# EAGLE design RCM-comm_v1 (EAGLE 6.5.0)
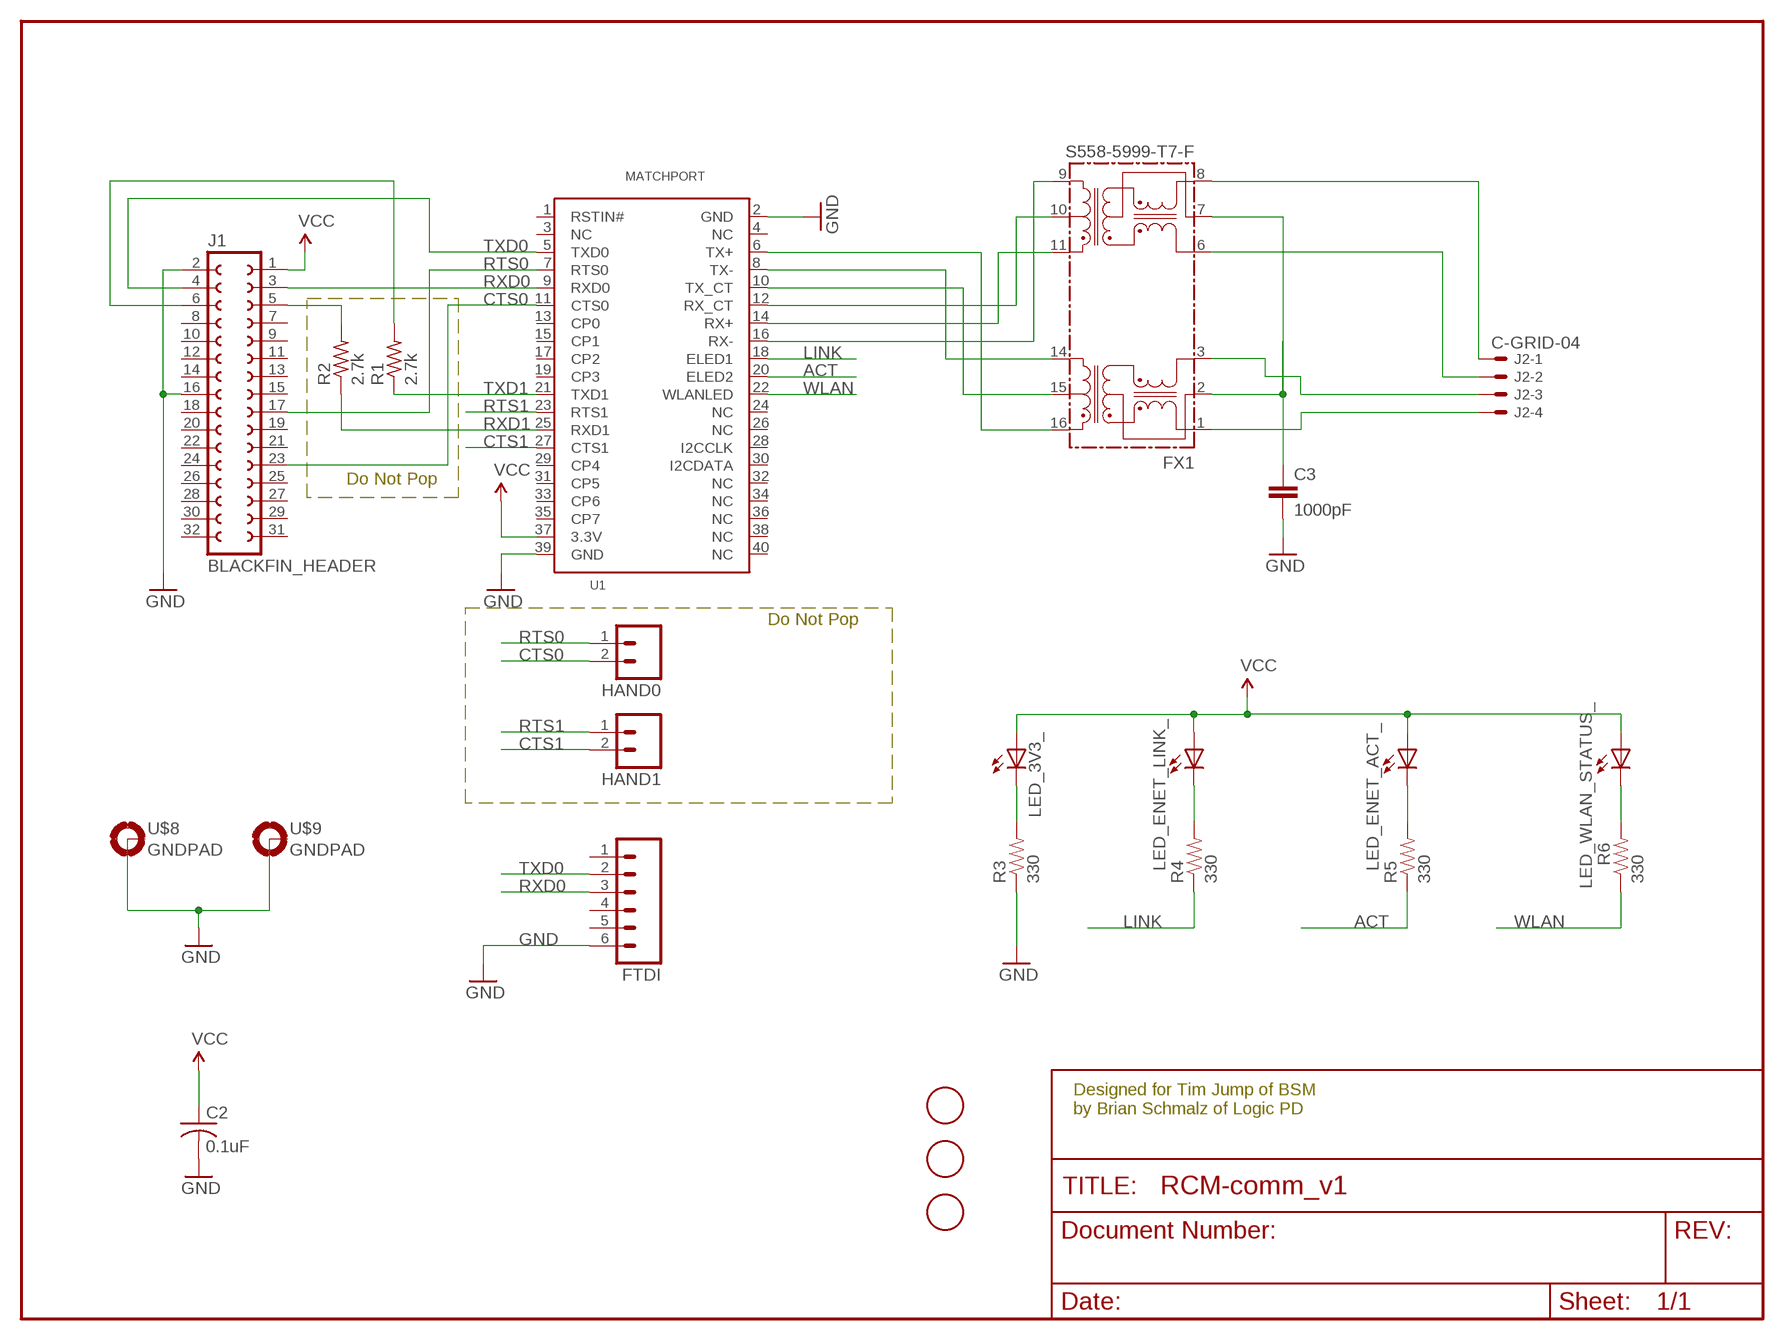
[diagram p0: schematic, sheet 1]

## Parts
C2  0.1uF  C-USC0603  [C0603]
C3  1000pF  CAP0603-CAP  [0603-CAP]
FID1  FIDUCIAL  [FIDUCIAL_1MM]
FID2  FIDUCIAL  [FIDUCIAL_1MM]
FID3  FIDUCIAL  [FIDUCIAL_1MM]
FTDI  M06SIP  [1X06]
FX1  S558-5999-T7-F  TG110-E050N5  [N5]
HAND0  M02PTH  [1X02]
HAND1  M02PTH  [1X02]
J1  BLACKFIN_HEADER  [2X16]
J2-  C-GRID-04  [70555-04]
LED_3V3_  LED0603  [LED-0603]
LED_ENET_ACT_  LED0603  [LED-0603]
LED_ENET_LINK_  LED0603  [LED-0603]
LED_WLAN_STATUS_  LED0603  [LED-0603]
R1  2.7k  R-US_0207/10  [0207/10]
R2  2.7k  R-US_0207/10  [0207/10]
R3  330  RESISTOR0603-RES  [0603-RES]
R4  330  RESISTOR0603-RES  [0603-RES]
R5  330  RESISTOR0603-RES  [0603-RES]
R6  330  RESISTOR0603-RES  [0603-RES]
U1  MATCHPORT  [MATCHPORT_LAYOUT]
U$8  GNDPAD  [GNDPAD]
U$9  GNDPAD  [GNDPAD]

## Nets
ACT: R5.1 U1.20(ELED2)
CTS0: HAND0.2 J1.23(GP6) U1.11(CTS0)
CTS1: HAND1.2 U1.27(CTS1)
GND: C2.2 C3.2 FTDI.6 J1.2(GND) J1.16(GND16) R3.1 U1.2(GND) U1.39(GND) U$8.P$1(MOUNT) U$9.P$1(MOUNT)
LINK: R4.1 U1.18(ELED1)
N$1: FX1.2
N$3: LED_3V3_.C R3.2
N$5: LED_ENET_LINK_.C R4.2
N$6: LED_ENET_ACT_.C R5.2
N$8: LED_WLAN_STATUS_.C R6.2
N$11: C3.1 FX1.7
N$12: FX1.15 U1.10(TX_CT)
N$13: FX1.16 U1.6(TX+)
N$14: FX1.14 U1.8(TX-)
N$15: FX1.10 U1.12(RX_CT)
N$16: FX1.11 U1.14(RX+)
N$17: FX1.9 U1.16(RX-)
N$18: FX1.1 J2-.4
N$19: FX1.3 J2-.3
N$20: FX1.8 J2-.1
N$21: FX1.6 J2-.2
N$24: J1.6(RX1) R1.2
N$26: J1.5(TX1) R2.2
RTS0: HAND0.1 J1.17(GP0) U1.7(RTS0)
RTS1: HAND1.1 U1.23(RTS1)
RXD0: FTDI.3 J1.3(TX0) U1.9(RXD0)
RXD1: R2.1 U1.25(RXD1)
TXD0: FTDI.2 J1.4(RX0) U1.5(TXD0)
TXD1: R1.1 U1.21(TXD1)
VCC: C2.1 J1.1(3.3V) LED_3V3_.A LED_ENET_ACT_.A LED_ENET_LINK_.A LED_WLAN_STATUS_.A U1.37(3.3V)
WLAN: R6.1 U1.22(WLANLED)
Unconnected: FTDI.1 FTDI.4 FTDI.5 J1.7(TMR2) J1.8(TMR3) J1.9(SPI_MOSI) J1.10(SPI_MISO) J1.11(SPI_SCK) J1.12(SPI_SEL) J1.13(SPI_SEL2) J1.14(SPI_SCL) J1.15(I2C_SDA) J1.18(GP1) J1.19(GP2) J1.20(GP3) J1.21(GP4) J1.22(GP5) J1.24(GP7) J1.25(GP8) J1.26(GP9) J1.27(GPA) J1.28(GPB) J1.29(GPC) J1.30(GPD) J1.31(GPE) J1.32(GPF) U1.1(RSTIN#) U1.3(NC) U1.4(NC) U1.13(CP0) U1.15(CP1) U1.17(CP2) U1.19(CP3) U1.24(NC) U1.26(NC) U1.28(I2CCLK) U1.29(CP4) U1.30(I2CDATA) U1.31(CP5) U1.32(NC) U1.33(CP6) U1.34(NC) U1.35(CP7) U1.36(NC) U1.38(NC) U1.40(NC)

## Notes on the sheet
- Do Not Pop
- Do Not Pop
- Designed for Tim Jump of BSM
  by Brian Schmalz of Logic PD

## Library data of the parts
C2 = rcl:C-US: CAPACITOR, American symbol
C3 = spark_fun:CAP: Capacitor Standard 0603 ceramic capacitor, and 0.1" leaded capacitor.
FID1-FID3 = adafruit:FIDUCIAL: For use by pick and place machines to calibrate the vision/machine, 1mm By microbuilder.eu
FTDI = spark_fun:M06: Header 6 Standard 6-pin 0.1" header. Use with straight break away headers (SKU : PRT-00116), right angle break away headers (PRT-00553), swiss pins (PRT-00743), machine pins (PRT-00117), and female headers (PRT-00115). Molex polarized connector foot print use with SKU : PRT-08094 with associated crimp pins and housings. NOTES ON THE VARIANTS LOCK and LOCK_LONGPADS... This footprint was designed to help hold the alignment of a through-hole component (i.e. 6-pin header) while soldering it into place. You may notice that each hole has been shifted either up or down by 0.005 of an inch from it's more standard position (which is a perfectly straight line). This slight alteration caused the pins (the squares in the middle) to touch the edges of the holes. Because they are alternating, it causes a "brace" to hold the component in place. 0.005 has proven to be the perfect amount of "off-center" position when using our standard breakaway headers. Although looks a little odd when you look at the bare footprint, once you have a header in there, the alteration is very hard to notice. Also, if you push a header all the way into place, it is covered up entirely on the bottom side. This idea of altering the position of holes to aid alignment will be further integrated into the Sparkfun Library for other footprints. It can help hold any component with 3 or more connection pins.
FX1 = halo-electronics:TG110-E050N5: E-Ultra (TM) 10/100BASE-TX SOIC-16 Fast Ethernet Magnetic Modules Source: www.haloelectronics.com .. e-ultra.pdf
HAND0 HAND1 = spark_fun:M02: Header 2 Standard 2-pin 0.1" header. Use with straight break away headers (SKU : PRT-00116), right angle break away headers (PRT-00553), swiss pins (PRT-00743), machine pins (PRT-00117), and female headers (PRT-00115). Molex polarized connector foot print use with SKU : PRT-08233 with associated crimp pins and housings.
J1 = Surveyor:BLACKFIN_HEADER
J2- = MolexConnector:C-GRID-04
LED_3V3_ LED_ENET_ACT_ LED_ENET_LINK_ LED_WLAN_STATUS_ = spark_fun:LED: LEDs Standard schematic elements and footprints for 5mm, 3mm, 1206, and 0603 sized LEDs. 5mm - Spark Fun Electronics SKU : COM-00529 (and others)
R1 R2 = rcl:R-US_: RESISTOR, American symbol
R3-R6 = spark_fun:RESISTOR: Resistor Basic schematic elements and footprints for 0603, 1206, and PTH resistors.
U1 = Matchport_Wiport:MATCHPORT
U$8 U$9 = Surveyor:GNDPAD

## Board
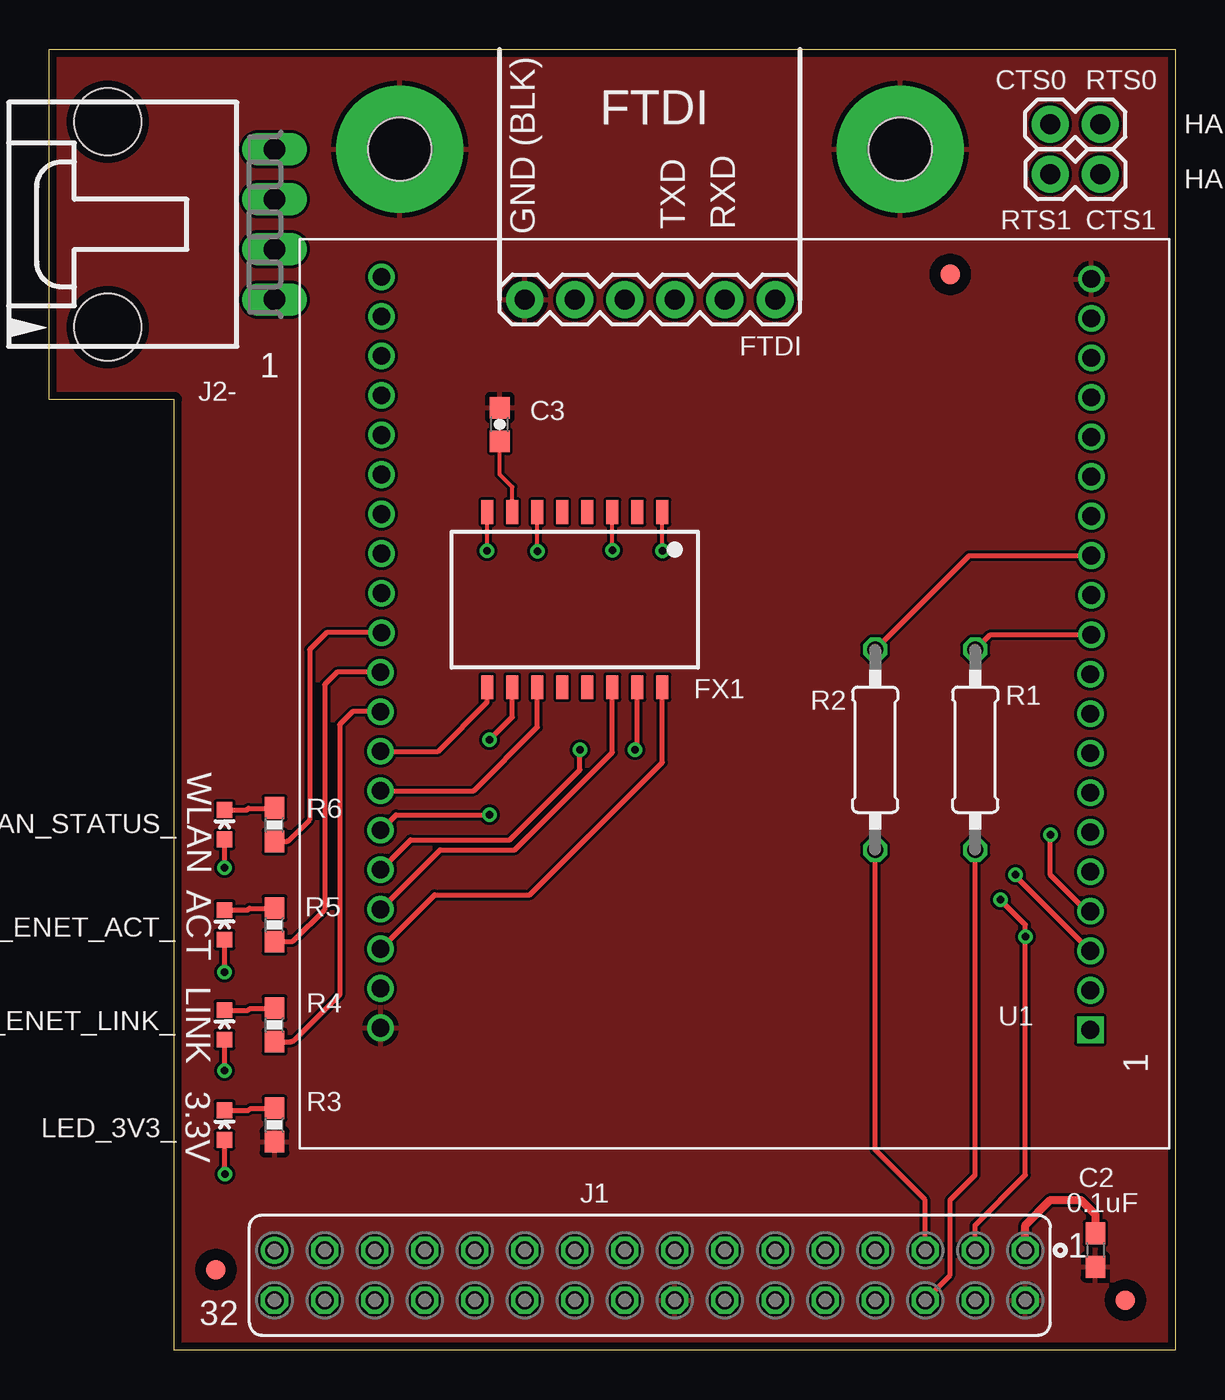
[diagram p1: board, top side]
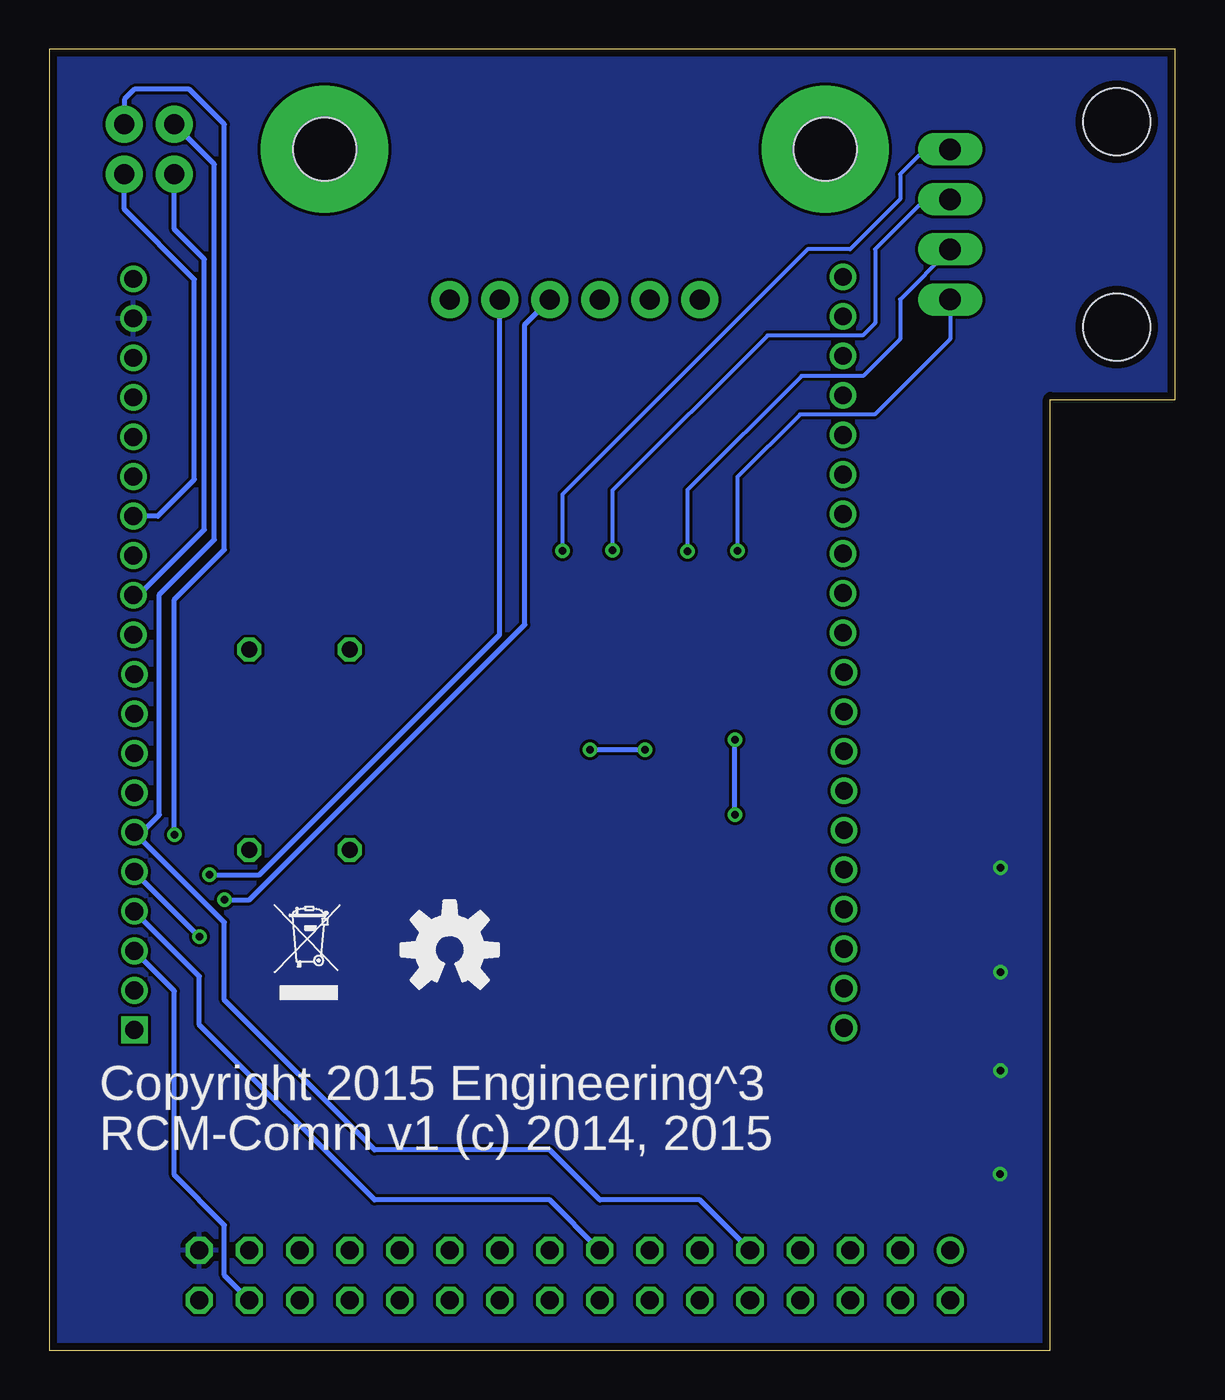
[diagram p2: board, bottom side, seen from below]

Size 57.15 x 66.05 mm. Coordinates in mm from the lower left corner, seen from the top.
Outline: 0,66.05 57.15,66.05 57.15,43.69 57.15,0 6.35,0.01 6.35,48.27 0,48.27 0,66.05
Copper layers (1*16): Top 0.0356mm / dielectric 1.5011mm / Bottom 0.0356mm
Design rules "LaenPCBOrder": minimum track width 6mil, minimum drill 13mil, track to track 6mil, track to pad 6mil, pad to pad 6mil, via to via 6mil, smd to smd 6mil, copper to edge 15mil, drill to drill 6mil, minimum pad ring 7mil, minimum via ring 7mil, stop-mask expansion 3mil, vias tented up to drill 0mil, thermal gap 10mil

### Footprints (pad centres in the part's own frame; a part is rotated, then mirrored left to right if it is on the bottom)
C0603 = smd 1.1 x 1: 1 -0.85,0; 2 0.85,0
0603-CAP = smd 1.1 x 1: 1 -0.85,0; 2 0.85,0
FIDUCIAL_1MM = smd 1 x 1: 1 0,0
1X06 = drill 1.016 pad 1.88: 1 0,0; 2 2.54,0; 3 5.08,0; 4 7.62,0; 5 10.16,0; 6 12.7,0
N5 = smd 0.6 x 1.2: 1 -4.445,-4.445; 2 -3.175,-4.445; 3 -1.905,-4.445; 4 -0.635,-4.445; 5 0.635,-4.445; 6 1.905,-4.445; 7 3.175,-4.445; 8 4.445,-4.445; 9 4.445,4.445; 10 3.175,4.445; 11 1.905,4.445; 12 0.635,4.445; 13 -0.635,4.445; 14 -1.905,4.445; 15 -3.175,4.445; 16 -4.445,4.445
1X02 = drill 1.016 pad 1.88: 1 0,0; 2 2.54,0
2X16 = drill 0.914 octagon: 1 20.32,1.27; 2 20.32,-1.27; 3 17.78,1.27; 4 17.78,-1.27; 5 15.24,1.27; 6 15.24,-1.27; 7 12.7,1.27; 8 12.7,-1.27; 9 10.16,1.27; 10 10.16,-1.27; 11 7.62,1.27; 12 7.62,-1.27; 13 5.08,1.27; 14 5.08,-1.27; 15 2.54,1.27; 16 2.54,-1.27; 17 0,1.27; 18 0,-1.27; 19 -2.54,1.27; 20 -2.54,-1.27; 21 -5.08,1.27; 22 -5.08,-1.27; 23 -7.62,1.27; 24 -7.62,-1.27; 25 -10.16,1.27; 26 -10.16,-1.27; 27 -12.7,1.27; 28 -12.7,-1.27; 29 -15.24,1.27; 30 -15.24,-1.27; 32 -17.78,-1.27 | drill 0.914: 31 -17.78,1.27
70555-04 = drill 1.092 long: 1 -3.81,0; 2 -1.27,0; 3 1.27,0; 4 3.81,0 | hole 3.404: -5.207,8.458; 5.207,8.458
LED-0603 = smd 0.8 x 0.8: A 0,-0.75; C 0,0.75
0207/10 = drill 0.813 octagon: 1 -5.08,0; 2 5.08,0
0603-RES = smd 1.1 x 1: 1 -0.85,0; 2 0.85,0
MATCHPORT_LAYOUT = drill 0.9 square: 1 0,0 | drill 0.9: 2 36.017,-0.102; 3 0,-2.007; 4 36.017,-2.108; 5 0,-4.013; 6 36.017,-4.115; 7 0,-6.02; 8 36.017,-6.121; 9 0,-8.026; 10 36.017,-8.128; 11 0,-10.033; 12 36.017,-10.135; 13 0,-12.04; 14 36.017,-12.141; 15 0,-14.046; 16 36.017,-14.148; 17 0,-16.053; 18 36.017,-16.154; 19 0,-18.059; 20 36.017,-18.161; 21 -0.051,-20.066; 22 35.966,-20.168; 23 -0.051,-22.073; 24 35.966,-22.174; 25 -0.051,-24.079; 26 35.966,-24.181; 27 -0.051,-26.086; 28 35.966,-26.187; 29 -0.051,-28.092; 30 35.966,-28.194; 31 -0.051,-30.099; 32 35.966,-30.201; 33 -0.051,-32.106; 34 35.966,-32.207; 35 -0.051,-34.112; 36 35.966,-34.214; 37 -0.051,-36.119; 38 35.966,-36.22; 39 -0.051,-38.125; 40 35.966,-38.227
GNDPAD = drill 3.2 pad 6.452: P$1 0,0 | hole 3.2: 0,0

### Placement (x,y rotation side)
C2  53.09,5.08 270 top
C3  22.86,47 90 top
FID1  8.46,4.09 0 top
FID2  45.72,54.62 0 top
FID3  54.61,2.54 0 top
FTDI  36.83,53.35 180 top
FX1  26.67,38.11 180 top
HAND0  53.34,62.23 180 top
HAND1  50.8,59.7 0 top
J1  29.21,3.81 0 top
J2-  11.43,57.16 90 top
LED_3V3_  8.89,11.44 0 top
LED_ENET_ACT_  8.89,21.59 0 top
LED_ENET_LINK_  8.89,16.52 0 top
LED_WLAN_STATUS_  8.89,26.68 0 top
LOGO1  OSHW-LOGOM  [OSHW-LOGO-M]  36.83,20.32 0 bottom
R1  46.99,30.48 270 top
R2  41.91,30.48 270 top
R3  11.43,11.44 90 top
R4  11.43,16.52 90 top
R5  11.43,21.59 90 top
R6  11.43,26.68 90 top
U1  52.83,16.26 180 top
U$3  ROHS_GARBAGE  [ROHS_GARBAGE_5MM]  45.72,17.79 0 bottom
U$8  17.78,60.97 90 top
U$9  43.18,60.97 0 top

### Tracks (layer width: path | path; a pad name or v marks a point on that pad's centre or on a via)
ACT
  Top 0.254: U1.20 14.61,34.42 13.97,33.79 13.97,22.36 12.43,20.82 arc-45 12.25,20.74 R5.1
CTS0
  Bottom 0.254: J1.23 24.13,7.62 29.21,7.62 31.75,10.17 40.64,10.17 48.26,17.79 48.26,21.72 U1.11 52.45,26.29 51.56,27.18 51.56,38.36 48.77,41.15 48.77,60.2 HAND0.2
CTS1
  Bottom 0.254: U1.27 51.64,42.35 49.78,44.2 49.78,54.36 53.34,57.92 HAND1.2
GND
  pour Top: 0,66.05 57.15,66.05 57.15,0.01 6.35,0.01 6.35,48.27 0,48.27
LINK
  Top 0.254: U1.18 15.39,32.41 14.73,31.75 14.73,18.04 12.43,15.74 arc-45 12.25,15.67 R4.1
N$3
  Top 0.254: LED_3V3_.C 10.12,12.19 10.21,12.27 11.42,12.27 R3.2
N$5
  Top 0.254: LED_ENET_LINK_.C 10.1,17.27 10.19,17.35 11.42,17.35 R4.2
N$6
  Top 0.254: LED_ENET_ACT_.C 10.07,22.34 10.16,22.43 11.42,22.43 R5.2
N$8
  Top 0.254: LED_WLAN_STATUS_.C 10.02,27.43 10.11,27.51 11.42,27.51 R6.2
N$11
  Top 0.203: FX1.7 23.49,43.82 22.86,44.46 C3.1
N$12  (via drill 0.38)
  Top 0.254: FX1.15 29.84,30.61 v29.72,30.48 | v26.92,30.48 26.92,29.47 23.37,25.91 18.34,25.91 U1.10
  Bottom 0.254: v26.92,30.48 v29.72,30.48
N$13
  Top 0.254: U1.6 19.56,23.12 24.38,23.12 31.11,29.85 FX1.16
N$14
  Top 0.254: FX1.14 28.57,30.36 23.62,25.4 19.84,25.4 U1.8
N$15  (via drill 0.38)
  Top 0.254: FX1.10 23.49,32.14 v22.35,30.99 | v22.35,27.18 17.6,27.18 U1.12
  Bottom 0.254: v22.35,27.18 v22.35,30.99
N$16
  Top 0.254: FX1.11 24.76,31.63 21.54,28.4 U1.14
N$17
  Top 0.254: U1.16 19.74,30.41 22.22,32.9 FX1.9
N$18  (via drill 0.38)
  Top 0.203: v31.11,40.59 FX1.1
  Bottom 0.203: v31.11,40.59 31.11,43.44 18.67,55.89 16.51,55.89 13.97,58.43 13.97,59.7 12.7,60.97 J2-.4
N$19  (via drill 0.38)
  Top 0.203: v28.57,40.62 FX1.3
  Bottom 0.203: v28.57,40.62 28.57,43.64 20.7,51.52 15.88,51.52 15.24,52.15 15.24,55.89 12.7,58.43 J2-.3
N$20  (via drill 0.38)
  Top 0.203: v22.22,40.59 FX1.8
  Bottom 0.203: J2-.1 11.43,51.34 15.27,47.5 19.05,47.5 22.22,44.33 v22.22,40.59
N$21  (via drill 0.38)
  Top 0.203: v24.76,40.57 FX1.6
  Bottom 0.203: v24.76,40.57 24.76,43.67 18.97,49.46 15.85,49.46 13.97,51.34 13.97,53.35 J2-.2
N$24
  Top 0.254: R1.2 46.99,8.9 45.72,7.62 45.72,3.81 J1.6
N$26
  Top 0.254: J1.5 44.45,7.62 41.91,10.17 R2.2
RTS0  (via drill 0.38)
  Top 0.254: v50.8,26.17 50.8,24.13 52.65,22.28 U1.7
  Bottom 0.254: v50.8,26.17 50.8,38.11 48.26,40.65 48.26,62.23 50.04,64.01 52.83,64.01 53.34,63.51 HAND0.1 | J1.17 31.75,7.62 40.64,7.62 49.53,16.52 49.53,18.98 U1.7
RTS1
  Bottom 0.254: U1.23 52.6,38.33 49.28,41.66 49.28,55.38 50.8,56.9 HAND1.1
RXD0  (via drill 0.38)
  Top 0.254: J1.3 46.99,6.35 49.53,8.9 v49.53,20.98 49.53,21.59 v48.26,22.86
  Bottom 0.254: v49.53,20.98 U1.9 | v48.26,22.86 46.99,22.86 33.02,36.84 33.02,52.08 FTDI.3
RXD1
  Top 0.254: U1.25 46.69,40.34 R2.1
TXD0  (via drill 0.38)
  Top 0.254: v49.02,24.13 49.02,24.08 U1.5
  Bottom 0.254: J1.4 48.26,3.81 48.26,6.35 50.8,8.9 50.8,18.24 U1.5 | FTDI.2 34.29,36.33 46.48,24.13 v49.02,24.13
TXD1
  Top 0.254: U1.21 47.75,36.33 R1.1
VCC  (via drill 0.38)
  Top 0.254: LED_WLAN_STATUS_.A v8.89,24.49 | LED_ENET_ACT_.A v8.89,19.18 | LED_ENET_LINK_.A v8.89,14.2 | LED_3V3_.A 8.89,9.01 arc45 v8.92,8.95
  Top 0.406: J1.1 49.53,6.35 50.8,7.62 52.35,7.62 53.09,6.89 C2.1
  Bottom 0.254: v8.89,24.49 8.9,24.49 arc45 8.97,24.52 | v8.89,19.18 8.98,19.18 arc-45 9.04,19.16 | v8.89,14.2 9.02,14.2 | v8.92,8.95 9.04,8.95
  pour Bottom: 0,66.05 57.15,66.05 57.15,0.01 6.35,0.01 6.35,48.27 0,48.27
WLAN
  Top 0.254: U1.22 14.07,36.43 13.21,35.57 13.21,26.93 12.18,25.9 arc-45 12,25.82 R6.1

### Text on the board
tPlace: CTS0 | RTS0 | FTDI | GND (BLK) | TXD | RXD | RTS1 | CTS1 | 1 | WLAN | ACT | LINK | 1 | 3.3V
bPlace: Copyright 2015 Engineering^3 | RCM-Comm v1 (c) 2014, 2015